# Altium schematic sheet 外设资源分配&上电时序.schdoc: =
size A4; Company: AD; Version: V1.0; Page Size: A4; @Project Name: RK3568B2地瓜派练习材料（建议不要照搬）; @Page Count: 3; @Update Date: 2026-08-26; @Create Date: 2025-08-15; @Schematic Name: Schematic1_1; @Page No: 0; @Page Name: 外设资源分配&上电时序; Device: Sheet-Symbol_A4; Border: 1; Title Block Position: 3; Width: 1170; Height: 825; Region Start: 1; X Region Count: 6; Y Region Count: 4; Blade Width: 10; @Board Name: 无走线; Organization: ORGANIZATION; Address1: ADDRESS 1; Address2: ADDRESS 2; Address3: ADDRESS 3; Address4: ADDRESS 4; SheetNumber: 2; SheetTotal: 28
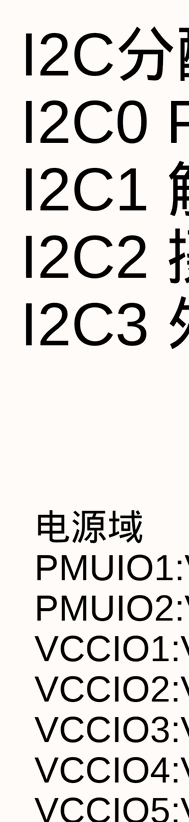
[diagram p0: 外设资源分配&上电时序.schdoc]

## Notes on the sheet
- I2C分配
  I2C0 PMIC（禁止他用）
  I2C1 触摸 3V3
  I2C2 摄像头 1V8
  I2C3 外设 AUD
- 电源域
  PMUIO1:VCC3V3_PMU
  PMUIO2:VCC3V3_PMU
  VCCIO1:VCCIO_ACODEC(3V3)
  VCCIO2:VCCIO_FLASH(VCC_1V8电阻配置)
  VCCIO3:VCCIO_SD(3v3&1v8)
  VCCIO4:VCCIO_WL（VCC_1V8）
  VCCIO5:VCC_3V3
  VCCIO6:VCC_1V8
  VCCIO7:VCC_3V3
- Drawn By :
- Checked By :
- Approved By :
- SheetNumber
- SheetTotal
- Revision :
- Time :
- Size :
- Date :
- A4
- DocumentName :
- Project :